# EAGLE design oshpark2.2 (EAGLE 6.6.0)
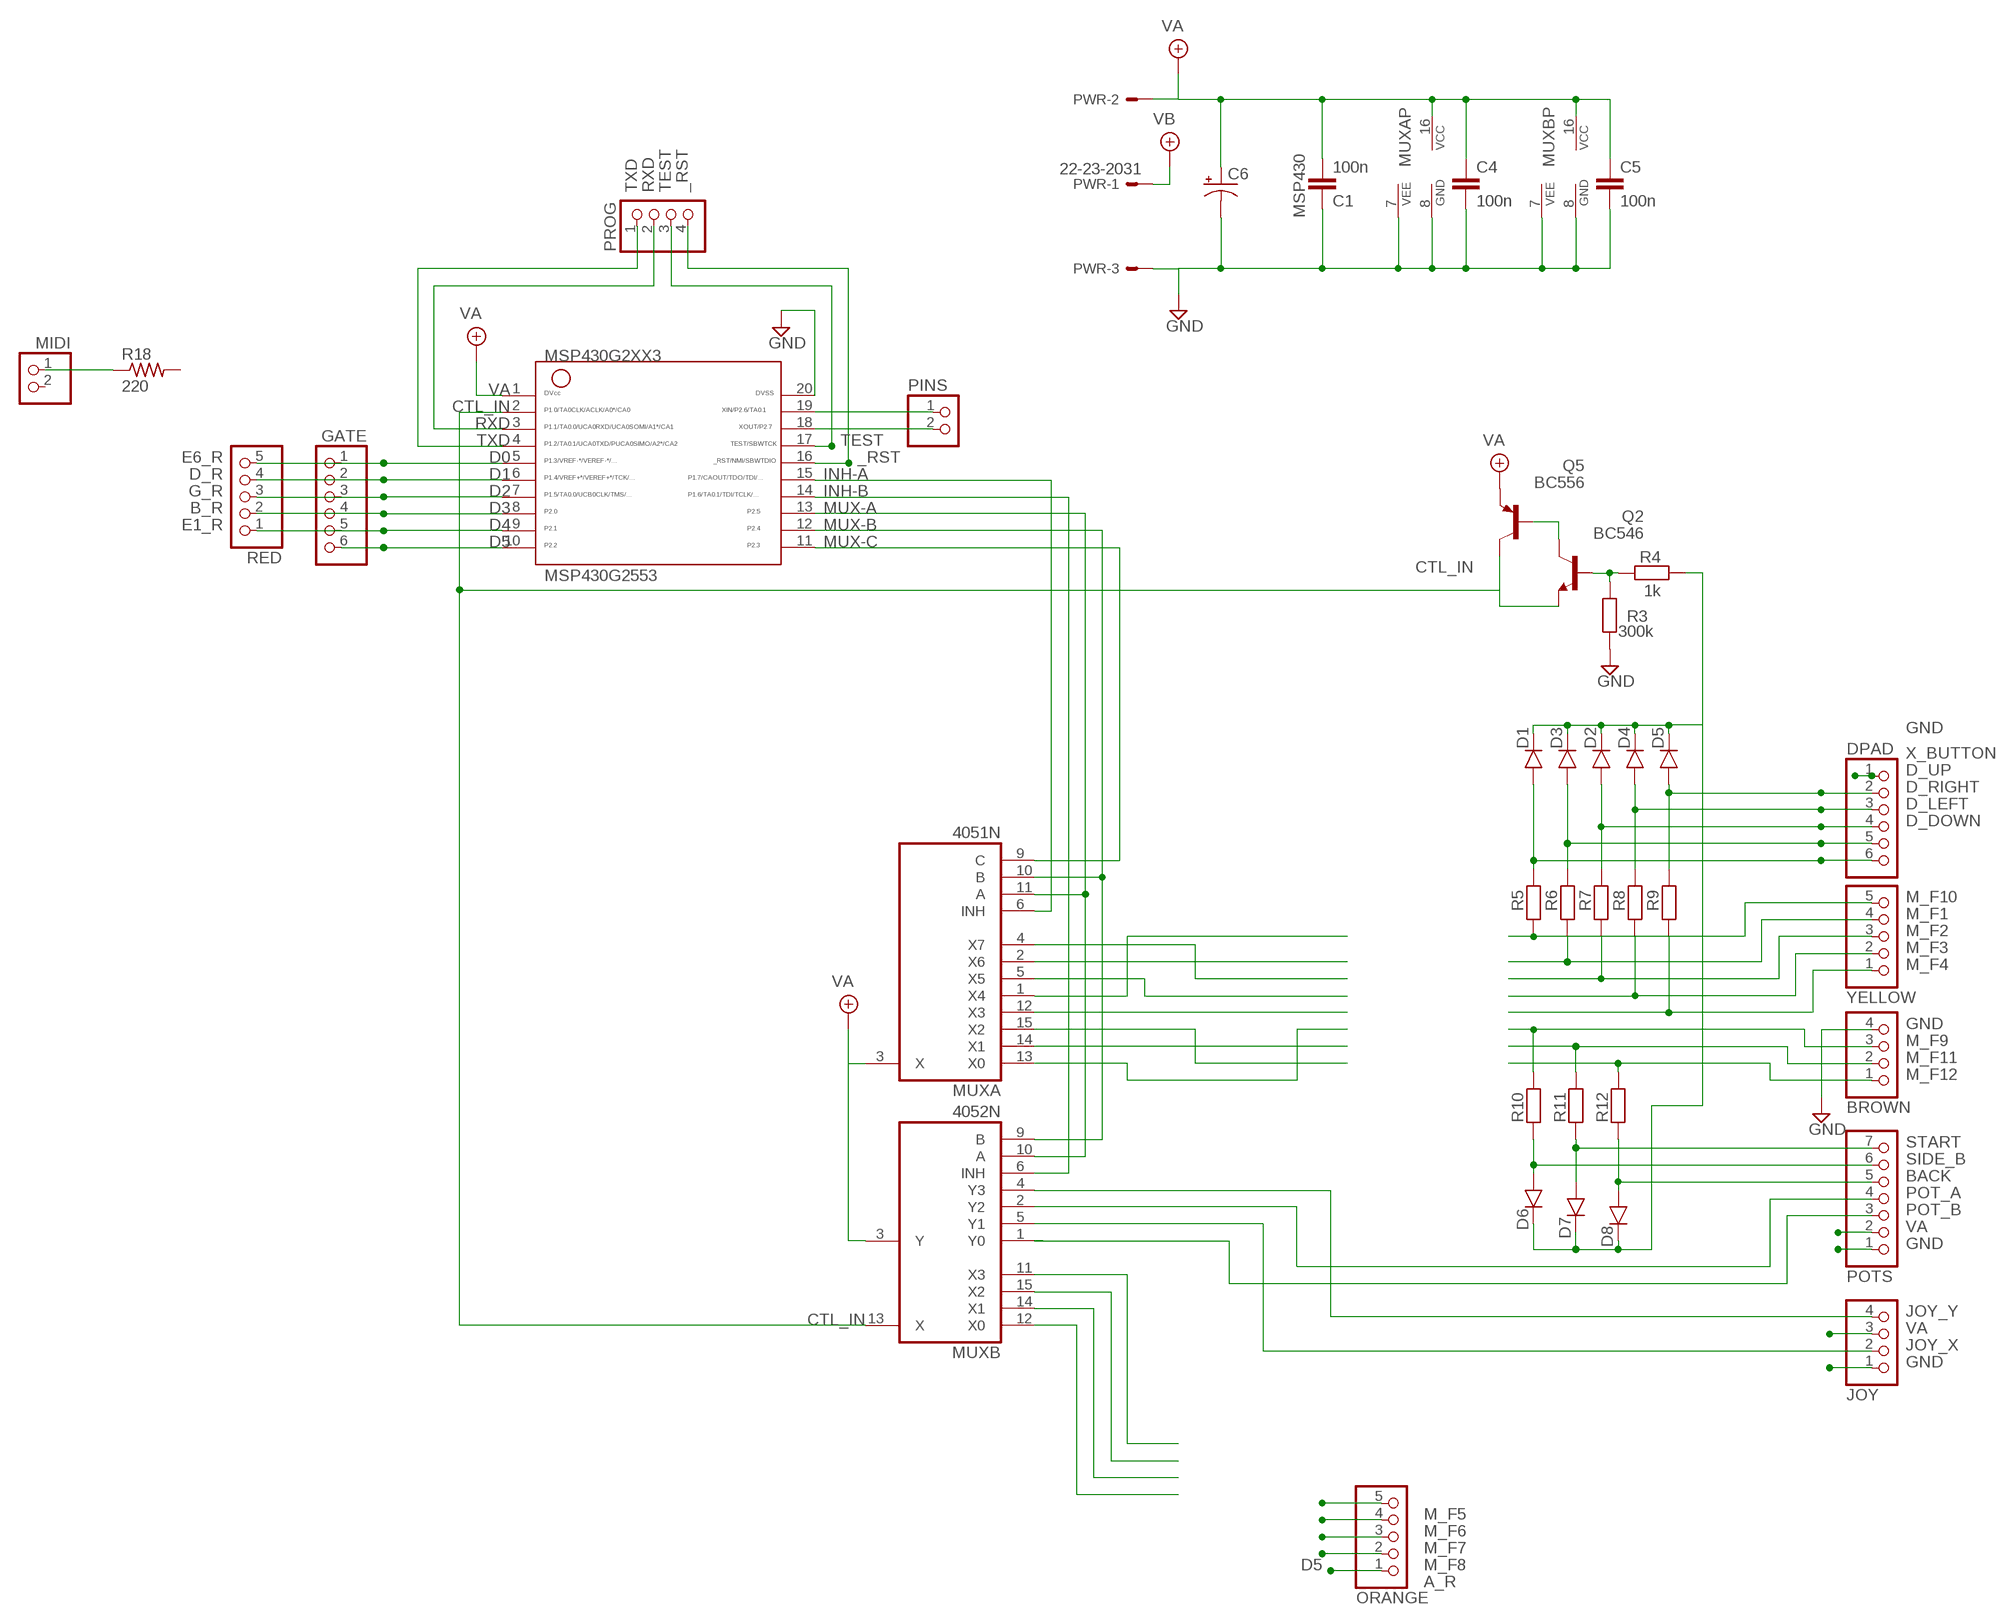
[diagram p0: schematic, sheet 1]

## Parts
BROWN  PINHD-1X4  [1X04]
C1  100n  050X030_050  [050X030_050_3]
C4  100n  050X030_0501  [050X030_050_1]
C5  100n  050X030_050  [050X030_050_3]
C6  0501  [050_020_1]
D1  1N4148-2  [DO35-2]
D2  1N4148-2  [DO35-2]
D3  1N4148-2  [DO35-2]
D4  1N4148-2  [DO35-2]
D5  1N4148-2  [DO35-2]
D6  1N4148-2  [DO35-2]
D7  1N4148-2  [DO35-2]
D8  1N4148-2  [DO35-2]
DPAD  PINHD-1X6  [1X06]
GATE  PINHD-1X6  [1X06]
JOY  PINHD-1X4  [1X04]
MIDI  PINHD-1X2  [1X02]
MSP430G2553  G2XX3---N20  [N20]
MUXA  4051N  [DIL16]
MUXB  4052N  [DIL16]
ORANGE  PINHD-1X5  [1X05]
PINS  PINHD-1X2  [1X02]
POTS  PINHD-1X7  [1X07]
PROG  PINHD-1X4  [1X04]
PWR  22-23-2031  [22-23-2031]
Q2  BC546  BC546B  [TO92-EBC]
Q5  BC556  [TO92-EBC]
R3  300k  6MM-EU1  [R0207/1V]
R4  1k  6MM-EU  [R0207/3]
R5  30k  6MM-EU1  [R0207/1V]
R6  30k  6MM-EU1  [R0207/1V]
R7  30k  6MM-EU1  [R0207/1V]
R8  30k  6MM-EU1  [R0207/1V]
R9  30k  6MM-EU1  [R0207/1V]
R10  30k  6MM-EU2  [R0207/2V]
R11  30k  6MM-EU2  [R0207/2V]
R12  30k  6MM-EU2  [R0207/2V]
R18  220  6MM.3  [R0207/3]
RED  PINHD-1X5  [1X05]
YELLOW  PINHD-1X5  [1X05]

## Nets
_RST: MSP430G2553.16 PROG.4
BACK: D7.A POTS.7 R11.2
CTL_IN: MSP430G2553.2 MUXB.13(X) Q2.E Q5.C
D0: GATE.1 MSP430G2553.5 RED.5
D1: GATE.2 MSP430G2553.6 RED.4
D2: GATE.3 MSP430G2553.7 RED.3
D3: GATE.4 MSP430G2553.8 RED.2
D4: GATE.5 MSP430G2553.9 RED.1
D5: GATE.6 MSP430G2553.10 ORANGE.1
D_DOWN: D1.A DPAD.6 R5.2
D_LEFT: D3.A DPAD.5 R6.2
D_RIGHT: D2.A DPAD.4 R7.2
D_UP: D4.A DPAD.3 R8.2
GND: BROWN.4 C1.1 C4.2 C5.2 C6.- DPAD.1 JOY.1 MSP430G2553.20 MUXA.7(VEE) MUXA.8(GND) MUXB.7(VEE) MUXB.8(GND) POTS.1 PWR.3 R3.2
INH-A: MSP430G2553.15 MUXA.6(INH)
INH-B: MSP430G2553.14 MUXB.6(INH)
JOY_X: JOY.2 MUXB.5(Y1)
JOY_Y: JOY.4 MUXB.4(Y3)
M_F1: R6.1 YELLOW.4
M_F2: R7.1 YELLOW.3
M_F3: R8.1 YELLOW.2
M_F4: R9.1 YELLOW.1
M_F5: ORANGE.5
M_F6: ORANGE.4
M_F7: ORANGE.3
M_F8: ORANGE.2
M_F9: BROWN.3 R10.1
M_F10: R5.1 YELLOW.5
M_F11: BROWN.2 R11.1
M_F12: BROWN.1 R12.1
MUX-A: MSP430G2553.13 MUXA.11(A) MUXB.10(A)
MUX-B: MUXA.10(B) MUXB.9(B)
MUX-C: MUXA.9(C)
N$1: MIDI.1 R18.1
N$2: Q2.C Q5.B
N$3: MUXB.12(X0)
N$4: MUXB.14(X1)
N$5: Q2.B R3.1 R4.2
N$6: MUXB.15(X2)
N$7: MUXB.11(X3)
N$8: MSP430G2553.19 PINS.1
N$9: MSP430G2553.18 PINS.2
N$10: MUXA.15(X2)
N$11: MUXA.14(X1)
N$12: MUXA.13(X0)
N$13: MUXA.12(X3)
N$14: MUXA.5(X5)
N$15: MUXA.4(X7)
N$16: MUXA.2(X6)
N$17: MUXA.1(X4)
N$19: D1.C D2.C D3.C D4.C D5.C D6.C D7.C D8.C R4.1
POT_A: MUXB.2(Y2) POTS.4
POT_B: MUXB.1(Y0) POTS.3
RXD: MSP430G2553.3 PROG.2
SIDE_B: D6.A POTS.6 R10.2
START: D8.A POTS.5 R12.2
TEST: MSP430G2553.17 PROG.3
TXD: MSP430G2553.4 PROG.1
VA: C1.2 C4.1 C5.1 C6.+ JOY.3 MSP430G2553.1 MUXA.3(X) MUXA.16(VCC) MUXB.3(Y) MUXB.16(VCC) POTS.2 PWR.2 Q5.E
VB: PWR.1
X_BUTTON: D5.A DPAD.2 R9.2
Unconnected: MIDI.2 MSP430G2553.11 MSP430G2553.12 R18.2

## Notes on the sheet
- MSP430
- E6_R
- D_R
- G_R
- B_R
- E1_R
- A_R

## Library data of the parts
BROWN JOY PROG = pinhead:PINHD-1X4: PIN HEADER
C1 C4 C5 = gm-caps-ceramic:050X030_050: 120 - 150pF Xicon Ceramic Disc 5mm lead spacing
C6 = gm-caps-electro-pol:050: 0.22 - 100uF Xicon values at Mouser.com: 10V: 10 - 100uF; 16V: 2.2 - 47uF; 25V: 0.47 - 47uF; 50V: 0.22 - 22uF
D1-D8 = gm-diodes:1N4148: Fast Switching Diode DO-35 glass case a.k.a. 1N914
DPAD GATE = pinhead:PINHD-1X6: PIN HEADER
MIDI PINS = pinhead:PINHD-1X2: PIN HEADER
MSP430G2553 = TI_MSP430_v16:G2XX3---N20: MSP430G2XX1 PDIP (N) 20 Pin Package
MUXA = 40xx:4051: 8-channel ANALOG MULTIPLEXER
MUXB = 40xx:4052: Dual 4-channel ANALOG MULTIPLEXER
ORANGE RED YELLOW = pinhead:PINHD-1X5: PIN HEADER
POTS = pinhead:PINHD-1X7: PIN HEADER
PWR = jaapie:22-23-2031: .100" (2.54mm) Center Header - 3 Pin; MF: MOLEX; MPN: 22-23-2031; OC_FARNELL: 1462950; OC_NEWARK: 30C0862
Q2 = transistor-npn:BC546*: NPN Transistor
Q5 = transistor-pnp:BC556*: PNP Transistror
R3-R12 = gm-resistors:6MM-EU: 6mm Resistors (European schematic symbol) Leads spaced 1-6 holes apart for 0.1" perfboard. Suitable for 1/4 watt resistors.
R18 = gm-resistors:6MM: 6mm Resistors Leads spaced 1-6 holes apart for 0.1" perfboard. Suitable for 1/4 watt resistors.

## Board
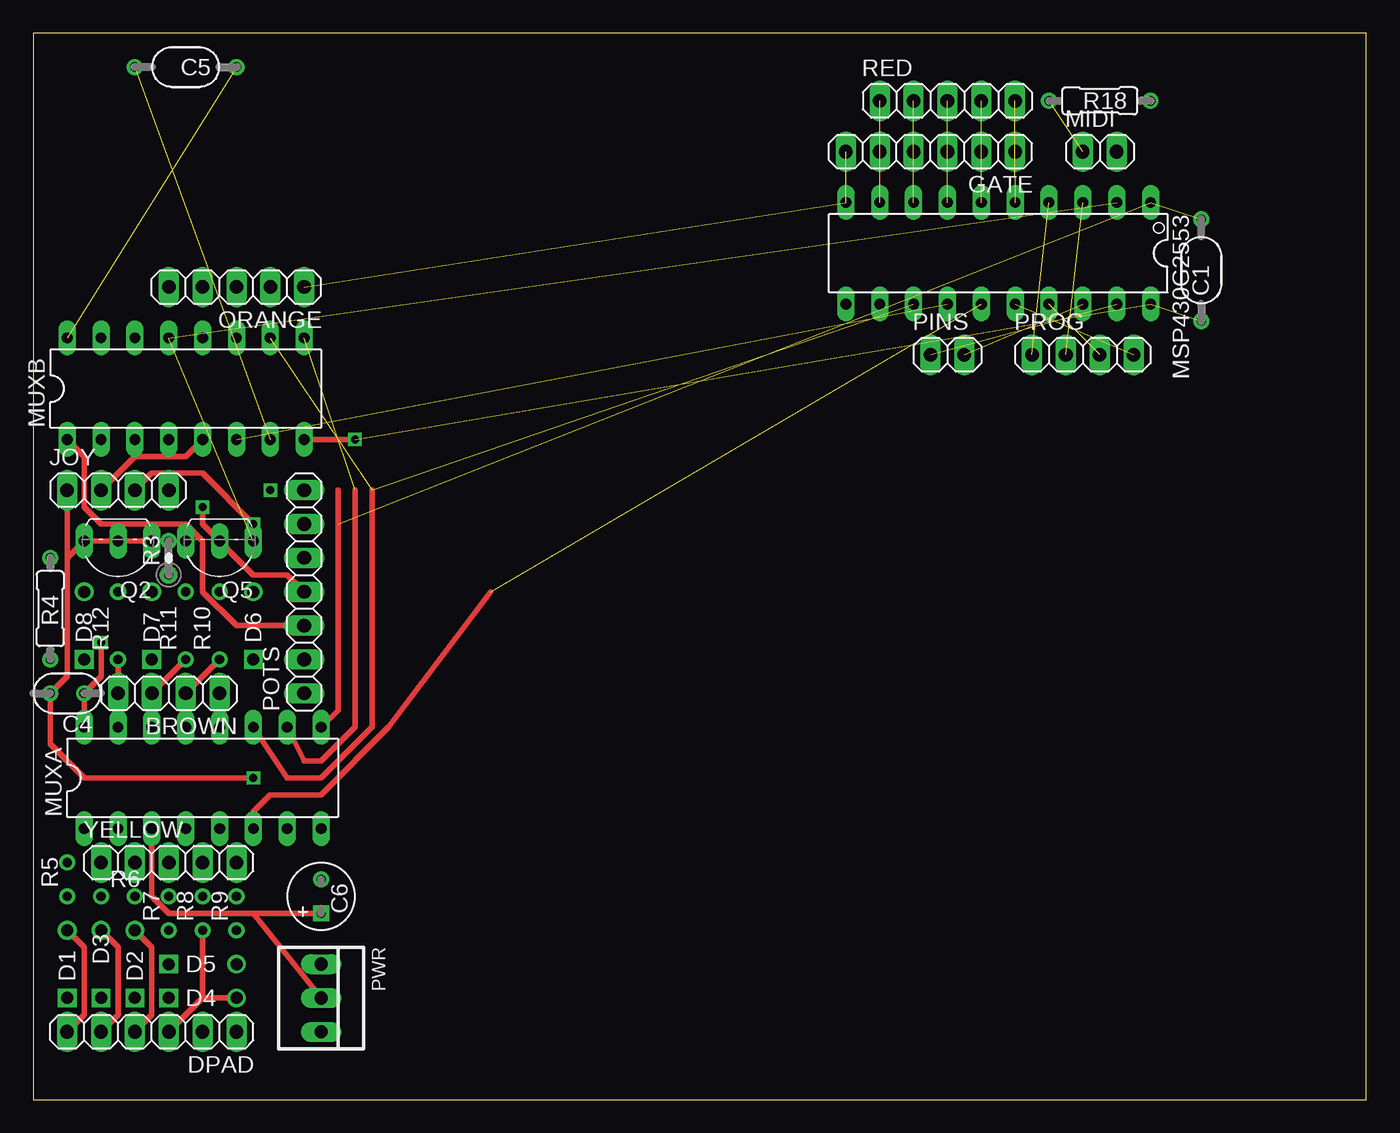
[diagram p1: board, top side]
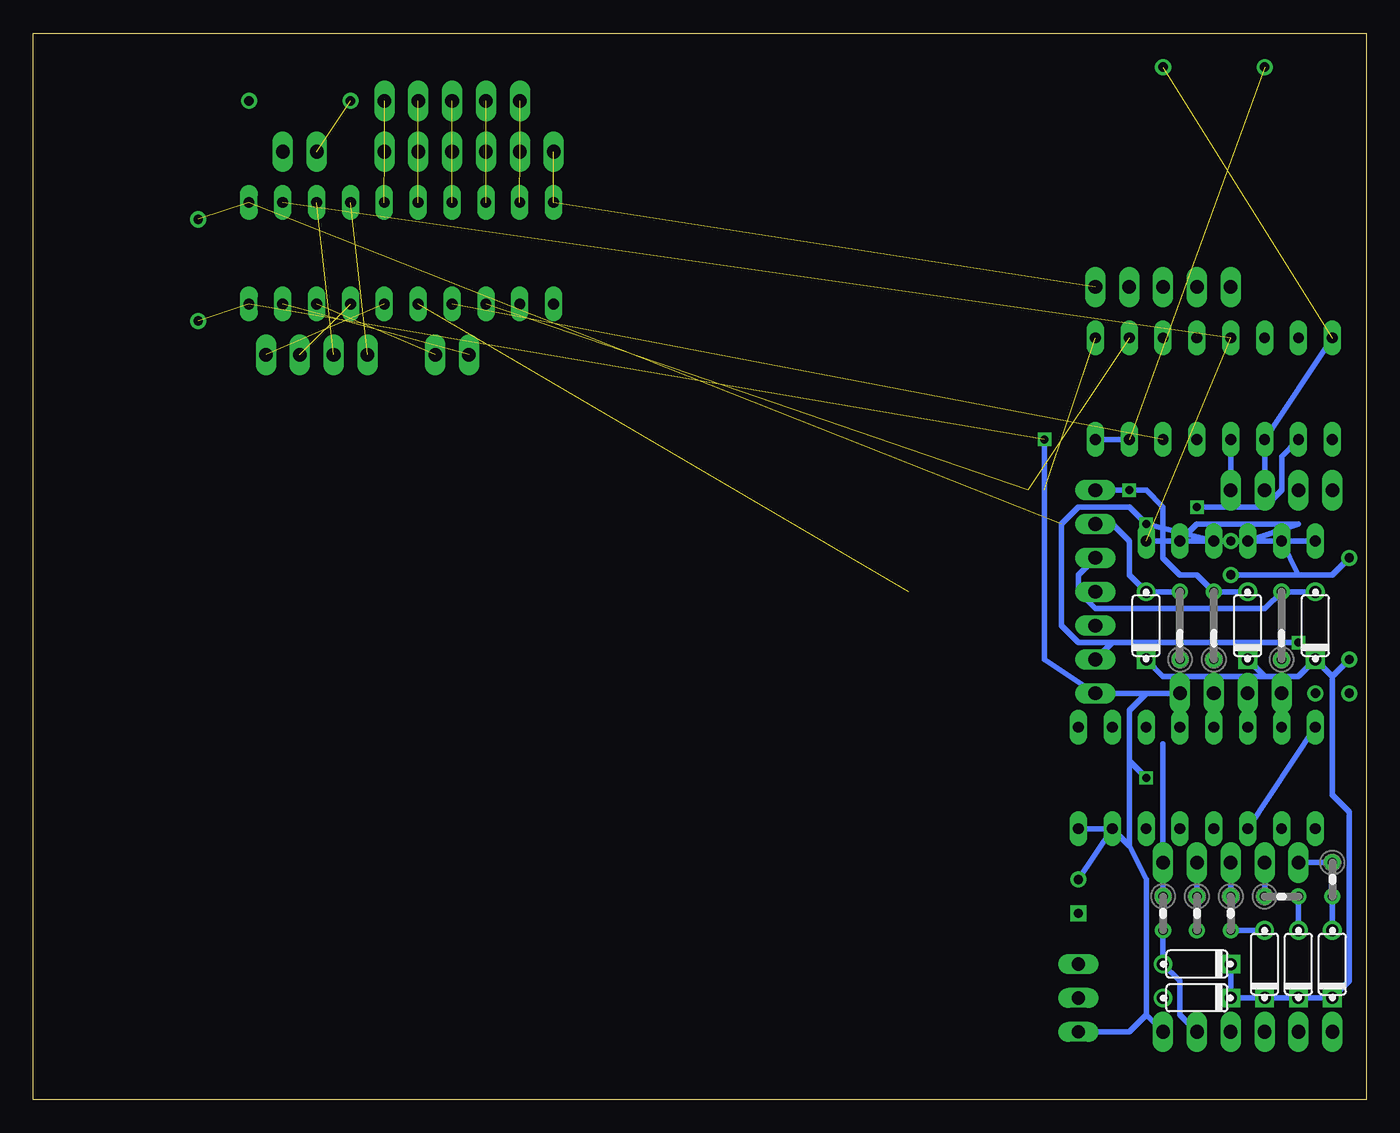
[diagram p2: board, bottom side, seen from below]

Size 100 x 80 mm. Coordinates in mm from the lower left corner, seen from the top.
Outline: 0,0 100,0 100,80 0,80 0,0
Copper layers (1*16): Top 0.035mm / dielectric 1.5mm / Bottom 0.035mm
Design rules "default": minimum track width 10mil, minimum drill 24mil, track to track 8mil, track to pad 8mil, pad to pad 8mil, via to via 8mil, smd to smd 8mil, copper to edge 40mil, drill to drill 8mil, minimum pad ring 10mil, minimum via ring 8mil, stop-mask expansion 4mil, vias tented up to drill 0mil, thermal gap 10mil

### Footprints (pad centres in the part's own frame; a part is rotated, then mirrored left to right if it is on the bottom)
1X04 = drill 1.016 long: 1 -3.81,0; 2 -1.27,0; 3 1.27,0; 4 3.81,0
050X030_050_3 = drill 0.7: 1 -3.81,0; 2 3.81,0
050X030_050_1 = drill 0.7: 1 -1.27,0; 2 1.27,0
050_020_1 = drill 0.7 square: + -1.27,0 | drill 0.7: - 1.27,0
DO35-2 = drill 0.9: A 2.54,0 | drill 0.9 square: C -2.54,0
1X06 = drill 1.016 long: 1 -6.35,0; 2 -3.81,0; 3 -1.27,0; 4 1.27,0; 5 3.81,0; 6 6.35,0
1X02 = drill 1.016 long: 1 -1.27,0; 2 1.27,0
N20 = drill 0.813 long: 1 -11.435,-3.81; 2 -8.895,-3.81; 3 -6.355,-3.81; 4 -3.815,-3.81; 5 -1.275,-3.81; 6 1.265,-3.81; 7 3.805,-3.81; 8 6.345,-3.81; 9 8.885,-3.81; 10 11.425,-3.81; 11 11.425,3.81; 12 8.885,3.81; 13 6.345,3.81; 14 3.805,3.81; 15 1.265,3.81; 16 -1.275,3.81; 17 -3.815,3.81; 18 -6.355,3.81; 19 -8.895,3.81; 20 -11.435,3.81
DIL16 = drill 0.813 long: 1 -8.89,-3.81; 2 -6.35,-3.81; 3 -3.81,-3.81; 4 -1.27,-3.81; 5 1.27,-3.81; 6 3.81,-3.81; 7 6.35,-3.81; 8 8.89,-3.81; 9 8.89,3.81; 10 6.35,3.81; 11 3.81,3.81; 12 1.27,3.81; 13 -1.27,3.81; 14 -3.81,3.81; 15 -6.35,3.81; 16 -8.89,3.81
1X05 = drill 1.016 long: 1 -5.08,0; 2 -2.54,0; 3 0,0; 4 2.54,0; 5 5.08,0
1X07 = drill 1.016 long: 1 -7.62,0; 2 -5.08,0; 3 -2.54,0; 4 0,0; 5 2.54,0; 6 5.08,0; 7 7.62,0
22-23-2031 = drill 1 long: 1 -2.54,0; 2 0,0; 3 2.54,0
TO92-EBC = drill 0.813 long: B 0,-1.27; C -2.54,-1.27; E 2.54,-1.27
R0207/1V = drill 0.7: 1 -1.27,0; 2 1.27,0
R0207/3 = drill 0.7: 1 -3.81,0; 2 3.81,0
R0207/2V = drill 0.7: 1 -2.54,0; 2 2.54,0

### Placement (x,y rotation side)
BROWN  10.16,30.48 0 top
C1  87.63,62.23 90 top
C4  2.54,30.48 180 top
C5  11.43,77.47 180 top
C6  21.59,15.24 90 top
D1  2.54,10.16 90 bottom
D2  7.62,10.16 90 bottom
D3  5.08,10.16 90 bottom
D4  12.7,7.62 180 bottom
D5  12.7,10.16 180 bottom
D6  16.51,35.56 90 bottom
D7  8.89,35.56 90 bottom
D8  3.81,35.56 90 bottom
DPAD  8.89,5.08 180 top
GATE  67.31,71.12 180 top
JOY  6.35,45.72 0 top
MIDI  80.01,71.12 0 top
MSP430G2553  72.39,63.5 180 top
MUXA  12.7,24.13 0 top
MUXB  11.43,53.34 0 top
ORANGE  15.24,60.96 180 top
PINS  68.58,55.88 0 top
POTS  20.32,38.1 90 top
PROG  78.74,55.88 0 top
PWR  21.59,7.62 270 top
Q2  6.35,40.64 180 top
Q5  13.97,40.64 180 top
R3  10.16,40.64 90 top
R4  1.27,36.83 90 top
R5  2.54,16.51 270 bottom
R6  6.35,15.24 0 bottom
R7  10.16,13.97 270 bottom
R8  12.7,13.97 270 bottom
R9  15.24,13.97 270 bottom
R10  13.97,35.56 90 bottom
R11  11.43,35.56 90 bottom
R12  6.35,35.56 90 bottom
R18  80.01,74.93 0 top
RED  68.58,74.93 0 top
YELLOW  10.16,17.78 180 top

### Tracks (layer width: path | path; a pad name or v marks a point on that pad's centre or on a via)
_RST  (1 unrouted)
BACK  (via drill 0.6)
  Bottom 0.406: D7.A R11.2 12.7,39.37 13.97,39.37 15.24,40.64 15.24,44.45 16.51,45.72 v17.78,45.72 POTS.7
CTL_IN  (2 unrouted)
  Bottom 0.406: Q2.E Q5.C
D0  (2 unrouted)
D1  (2 unrouted)
D2  (2 unrouted)
D3  (2 unrouted)
D4  (2 unrouted)
D5  (2 unrouted)
D_DOWN
  Top 0.406: D1.A 3.81,11.43 3.81,6.35 DPAD.6
  Bottom 0.406: R5.2 D1.A
D_LEFT
  Top 0.406: D3.A 6.35,11.43 6.35,6.35 DPAD.5
  Bottom 0.406: D3.A R6.2
D_RIGHT  (via drill 0.6)
  Top 0.406: D2.A 8.89,11.43 8.89,6.35 DPAD.4
  Bottom 0.406: R7.2 D2.A
  other vias: 7.62,12.7
D_UP
  Top 0.406: DPAD.3 12.7,7.62 | 12.7,7.62 R8.2 | D4.A 12.7,7.62
GND  (via drill 0.6)  (3 unrouted)
  Top 0.406: v16.51,24.13 3.81,24.13 1.27,26.67 C4.2 2.54,31.75 2.54,40.64 | R3.2 3.81,41.91 2.54,40.64 | v24.13,49.53 MUXB.8 | 2.54,40.64 JOY.1
  Bottom 0.406: MUXA.8 MUXA.7 | 17.78,19.05 17.78,25.4 | 17.78,25.4 17.78,29.21 16.51,30.48 | MUXA.7 17.78,19.05 | v16.51,24.13 17.78,25.4 | 16.51,6.35 DPAD.1 | 16.51,6.35 16.51,16.51 17.78,19.05 | BROWN.4 16.51,30.48 | 16.51,30.48 POTS.1 24.13,33.02 v24.13,49.53 | 16.51,6.35 17.78,5.08 PWR.3 | C6.- MUXA.7 | MUXB.7 MUXB.8
INH-A  (1 unrouted)
  Top 0.406: MUXA.6 16.51,21.59 17.78,22.86 21.59,22.86 26.67,27.94 34.29,38.1
INH-B  (1 unrouted)
JOY_X
  Top 0.406: JOY.2 7.62,48.26 11.43,48.26 MUXB.5
JOY_Y
  Bottom 0.406: MUXB.4 JOY.4
M_F1
  Bottom 0.406: YELLOW.4 R6.1
M_F2
  Bottom 0.406: R7.1 YELLOW.3
M_F3
  Bottom 0.406: R8.1 YELLOW.2
M_F4
  Bottom 0.406: R9.1 YELLOW.1 15.24,26.67
M_F9
  Top 0.406: BROWN.3 R10.1
M_F10
  Bottom 0.406: R5.1 YELLOW.5
M_F11
  Top 0.406: BROWN.2 R11.1
M_F12
  Top 0.406: BROWN.1 R12.1
MUX-A  (2 unrouted)
  Top 0.406: MUXA.11 19.05,24.13 21.59,24.13 25.4,27.94 25.4,45.72
MUX-B  (1 unrouted)
  Top 0.406: MUXA.10 20.32,25.4 21.59,25.4 24.13,27.94 24.13,45.72
MUX-C
  Top 0.406: MUXA.9 22.86,29.21 22.86,45.72
N$1  (1 unrouted)
N$2
  Bottom 0.406: Q2.C 5.08,43.18 12.7,43.18 Q5.B
N$5
  Bottom 0.406: R4.2 2.54,39.37 5.08,39.37 | Q2.B 5.08,39.37 | 5.08,39.37 R3.1
N$8  (1 unrouted)
N$9  (1 unrouted)
N$19
  Bottom 0.406: R4.1 2.54,31.75 | 2.54,31.75 2.54,22.86 1.27,21.59 1.27,8.89 D1.C | D4.C D2.C D3.C D1.C | D5.C D4.C | D4.C D1.C | 2.54,31.75 D8.C 5.08,31.75 7.62,31.75 | 7.62,31.75 15.24,31.75 D6.C | D7.C 7.62,31.75
POT_A  (via drill 0.6)
  Top 0.406: POTS.4 19.05,39.37 16.51,39.37 12.7,43.18 v12.7,44.45
  Bottom 0.406: v12.7,44.45 7.62,44.45 6.35,45.72 6.35,48.26 MUXB.2
POT_B
  Top 0.406: POTS.3 15.24,35.56 12.7,38.1 12.7,41.91 11.43,43.18 5.08,43.18 3.81,44.45 3.81,48.26 MUXB.1
RXD  (1 unrouted)
SIDE_B
  Bottom 0.406: POTS.6 19.05,43.18 17.78,41.91 17.78,39.37 D6.A R10.2
START
  Bottom 0.406: POTS.5 21.59,39.37 21.59,38.1 20.32,36.83 7.62,36.83 R12.2 D8.A
TEST  (1 unrouted)
TXD  (1 unrouted)
VA  (via drill 0.6)  (3 unrouted)
  Top 0.406: MUXA.16 C4.1 5.08,31.75 v5.08,34.29 | MUXA.3 8.89,15.24 10.16,13.97 16.51,13.97 | 16.51,13.97 PWR.2 | 16.51,13.97 C6.+ | JOY.3 8.89,46.99 12.7,46.99 v16.51,43.18
  Bottom 0.406: MUXB.16 MUXB.3 JOY.3 | MUXA.16 MUXA.3 | v5.08,34.29 19.05,34.29 | POTS.2 19.05,34.29 | 19.05,34.29 21.59,34.29 22.86,35.56 22.86,43.18 21.59,44.45 17.78,44.45 v16.51,43.18 Q5.E
X_BUTTON
  Bottom 0.406: R9.2 D5.A 13.97,8.89 13.97,6.35 DPAD.2